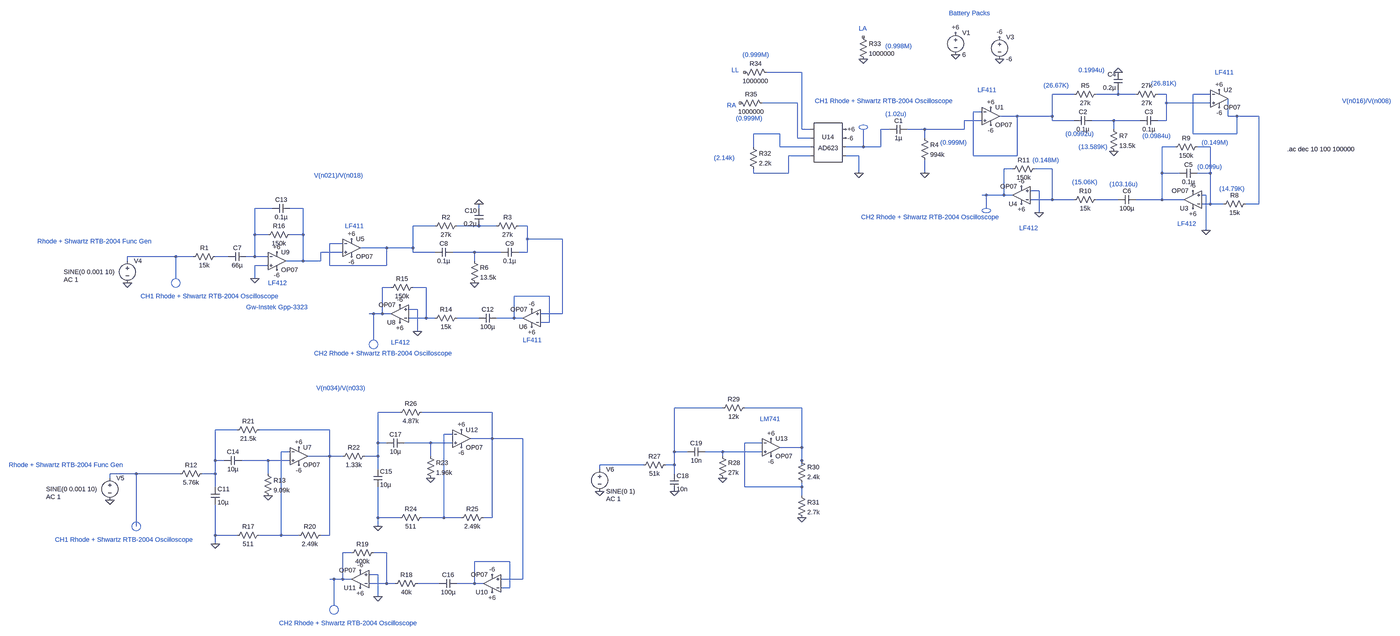
[diagram p0: schematic ECG_Circuit.asc, whole sheet]
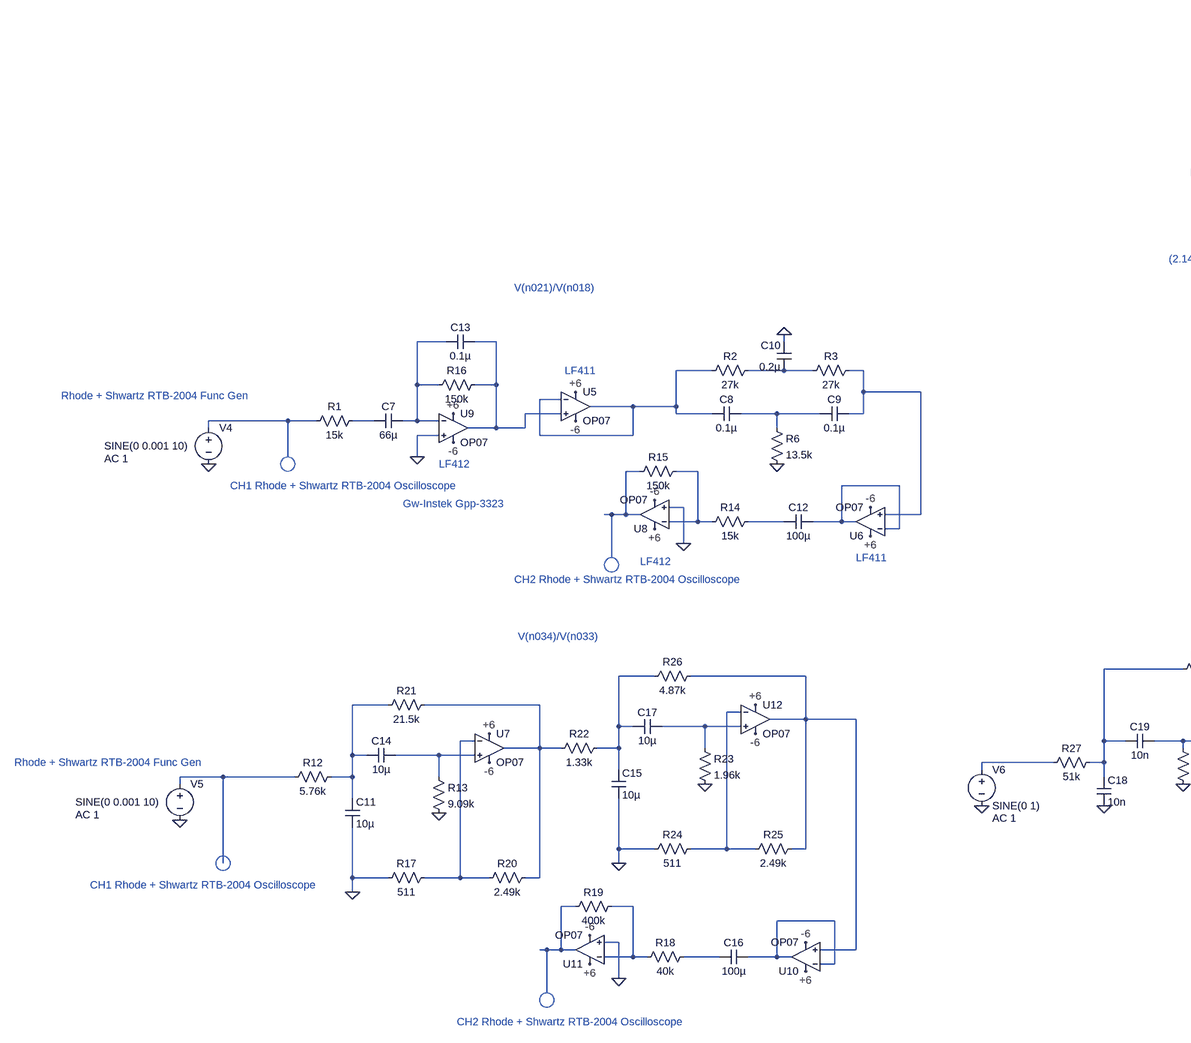
[diagram p1: schematic ECG_Circuit.asc, part, row 1 of 1, column 1 of 2]
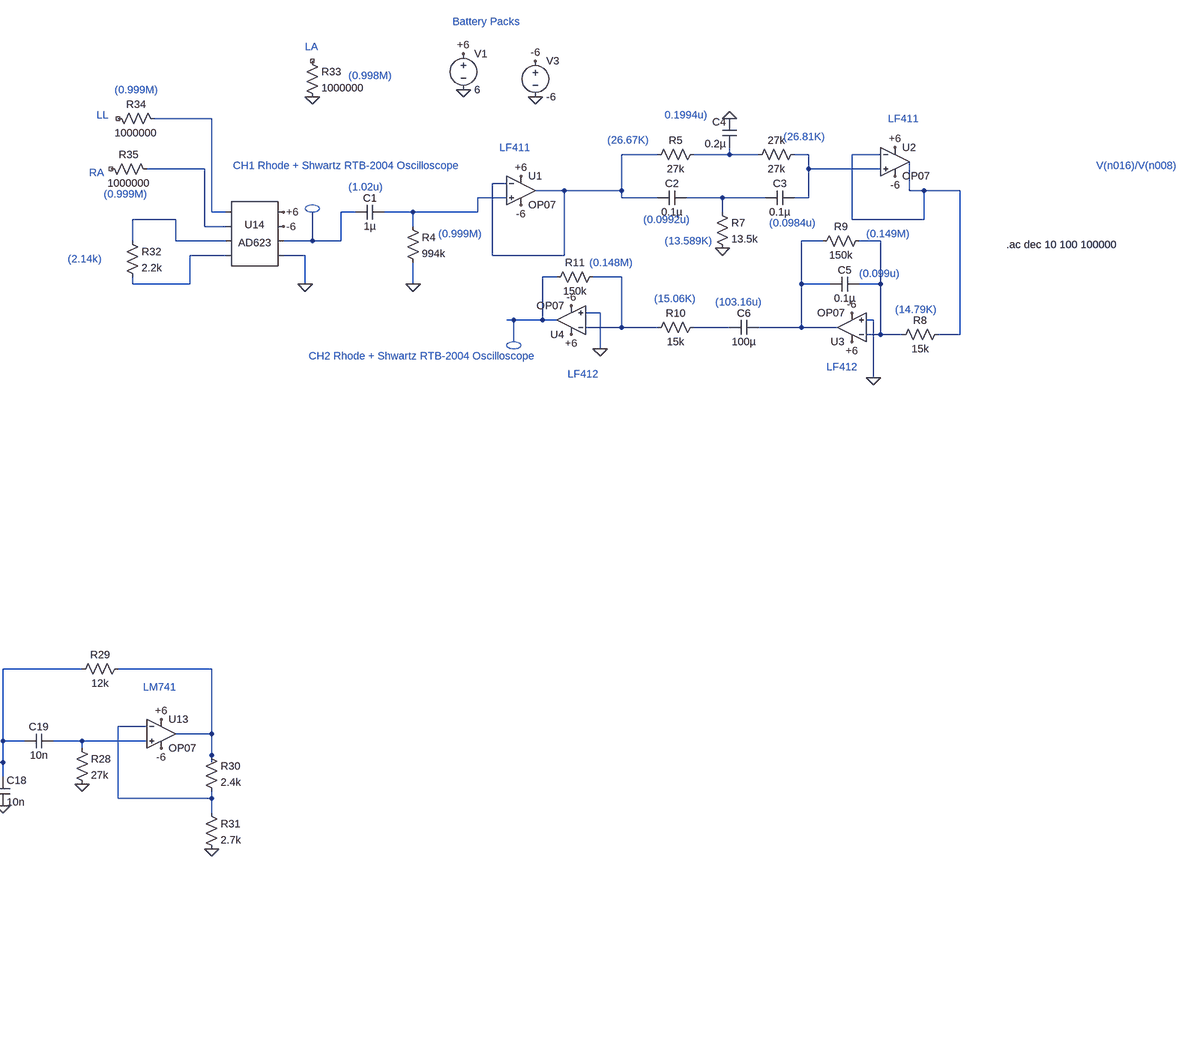
[diagram p2: schematic ECG_Circuit.asc, part, row 1 of 1, column 2 of 2]
ECG_Circuit.asc, the LTspice schematic file:
Version 4
SHEET 1 4284 1440
WIRE 1824 -640 1696 -640
WIRE 2816 -560 2736 -560
WIRE 2976 -560 2976 -576
WIRE 2976 -560 2896 -560
WIRE 3040 -560 2976 -560
WIRE 3152 -560 3120 -560
WIRE 3312 -560 3248 -560
WIRE 1808 -528 1680 -528
WIRE 3152 -528 3152 -560
WIRE 3312 -528 3152 -528
WIRE 2480 -496 2448 -496
WIRE 2608 -480 2544 -480
WIRE 2736 -480 2736 -560
WIRE 2736 -480 2608 -480
WIRE 3376 -480 3376 -544
WIRE 3408 -480 3376 -480
WIRE 3488 -480 3408 -480
WIRE 2480 -464 2416 -464
WIRE 2736 -464 2736 -480
WIRE 2816 -464 2736 -464
WIRE 2960 -464 2880 -464
WIRE 3056 -464 2960 -464
WIRE 3152 -464 3152 -528
WIRE 3152 -464 3120 -464
WIRE 1824 -432 1824 -640
WIRE 1856 -432 1824 -432
WIRE 2144 -432 2112 -432
WIRE 2272 -432 2208 -432
WIRE 2416 -432 2416 -464
WIRE 2416 -432 2272 -432
WIRE 2960 -432 2960 -464
WIRE 1744 -416 1648 -416
WIRE 3248 -416 3248 -560
WIRE 3408 -416 3408 -480
WIRE 3408 -416 3248 -416
WIRE 1808 -400 1808 -528
WIRE 1856 -400 1808 -400
WIRE 2272 -400 2272 -432
WIRE 1648 -368 1648 -416
WIRE 1744 -368 1744 -416
WIRE 1856 -368 1744 -368
WIRE 2048 -368 2048 -432
WIRE 2048 -368 1984 -368
WIRE 2112 -368 2112 -432
WIRE 2112 -368 2048 -368
WIRE 3184 -368 3136 -368
WIRE 3312 -368 3264 -368
WIRE 1856 -336 1776 -336
WIRE 2032 -336 1984 -336
WIRE 2448 -336 2448 -496
WIRE 2608 -336 2608 -480
WIRE 2608 -336 2448 -336
WIRE 2592 -288 2560 -288
WIRE 2736 -288 2672 -288
WIRE 1648 -272 1648 -288
WIRE 1776 -272 1776 -336
WIRE 1776 -272 1648 -272
WIRE 2032 -272 2032 -336
WIRE 2272 -272 2272 -320
WIRE 3136 -272 3136 -368
WIRE 3200 -272 3136 -272
WIRE 3312 -272 3312 -368
WIRE 3312 -272 3264 -272
WIRE 2688 -208 2656 -208
WIRE 2496 -192 2480 -192
WIRE 2560 -192 2560 -288
WIRE 2560 -192 2496 -192
WIRE 2592 -192 2560 -192
WIRE 3296 -192 3280 -192
WIRE 2736 -176 2736 -288
WIRE 2736 -176 2656 -176
WIRE 2816 -176 2736 -176
WIRE 2976 -176 2896 -176
WIRE 3136 -176 3136 -272
WIRE 3136 -176 3040 -176
WIRE 3216 -176 3136 -176
WIRE 3312 -160 3312 -272
WIRE 3312 -160 3280 -160
WIRE 3360 -160 3312 -160
WIRE 3488 -160 3488 -480
WIRE 3488 -160 3440 -160
WIRE -240 -144 -304 -144
WIRE -128 -144 -176 -144
WIRE 512 -144 512 -160
WIRE 2496 -144 2496 -192
WIRE 2688 -128 2688 -208
WIRE 352 -80 272 -80
WIRE 512 -80 512 -96
WIRE 512 -80 432 -80
WIRE 576 -80 512 -80
WIRE 688 -80 656 -80
WIRE 3296 -64 3296 -192
WIRE -304 -48 -304 -144
WIRE -256 -48 -304 -48
WIRE -128 -48 -128 -144
WIRE -128 -48 -176 -48
WIRE 688 -32 688 -80
WIRE 816 -32 688 -32
WIRE 16 -16 -32 -16
WIRE 176 0 80 0
WIRE 272 0 272 -80
WIRE 272 0 176 0
WIRE 16 16 -64 16
WIRE 272 16 272 0
WIRE 352 16 272 16
WIRE 496 16 416 16
WIRE 592 16 496 16
WIRE 688 16 688 -32
WIRE 688 16 656 16
WIRE -592 32 -768 32
WIRE -528 32 -592 32
WIRE -400 32 -448 32
WIRE -304 32 -304 -48
WIRE -304 32 -336 32
WIRE -256 32 -304 32
WIRE -768 48 -768 32
WIRE -128 48 -128 -48
WIRE -128 48 -192 48
WIRE -64 48 -64 16
WIRE -64 48 -128 48
WIRE 496 48 496 16
WIRE -256 64 -304 64
WIRE -32 64 -32 -16
WIRE 176 64 176 0
WIRE 176 64 -32 64
WIRE -592 112 -592 32
WIRE -304 112 -304 64
WIRE 192 144 160 144
WIRE 320 144 272 144
WIRE 768 176 640 176
WIRE 288 224 256 224
WIRE 128 240 112 240
WIRE 160 240 160 144
WIRE 160 240 128 240
WIRE 192 240 160 240
WIRE 816 240 816 -32
WIRE 816 240 736 240
WIRE 320 256 320 144
WIRE 320 256 256 256
WIRE 352 256 320 256
WIRE 512 256 432 256
WIRE 640 256 640 176
WIRE 640 256 576 256
WIRE 672 256 640 256
WIRE 768 272 768 176
WIRE 768 272 736 272
WIRE 288 304 288 224
WIRE 128 336 128 240
WIRE 1536 640 1360 640
WIRE 1824 640 1616 640
WIRE 224 656 144 656
WIRE 560 656 304 656
WIRE -368 720 -448 720
WIRE -32 720 -288 720
WIRE 416 736 384 736
WIRE 560 752 560 656
WIRE 560 752 480 752
WIRE 672 752 560 752
WIRE 144 768 144 656
WIRE 176 768 144 768
WIRE 336 768 240 768
WIRE 416 768 336 768
WIRE 1680 768 1616 768
WIRE 1824 784 1824 640
WIRE 1824 784 1744 784
WIRE -176 800 -208 800
WIRE 1360 800 1360 640
WIRE 1408 800 1360 800
WIRE 1536 800 1472 800
WIRE 1680 800 1536 800
WIRE -32 816 -32 720
WIRE -32 816 -112 816
WIRE 16 816 -32 816
WIRE 144 816 144 768
WIRE 144 816 96 816
WIRE 336 816 336 768
WIRE 1536 816 1536 800
WIRE -448 832 -448 720
WIRE -416 832 -448 832
WIRE -256 832 -352 832
WIRE -176 832 -256 832
WIRE 1824 832 1824 784
WIRE 1248 848 1088 848
WIRE 1360 848 1360 800
WIRE 1360 848 1328 848
WIRE 1824 848 1824 832
WIRE 144 864 144 816
WIRE 1088 864 1088 848
WIRE -736 880 -832 880
WIRE -576 880 -736 880
WIRE -448 880 -448 832
WIRE -448 880 -496 880
WIRE -256 880 -256 832
WIRE 1360 880 1360 848
WIRE -832 896 -832 880
WIRE -448 928 -448 880
WIRE 1616 928 1616 768
WIRE 1824 928 1824 912
WIRE 1824 928 1616 928
WIRE 1824 960 1824 928
WIRE 144 1040 144 928
WIRE 224 1040 144 1040
WIRE 384 1040 384 736
WIRE 384 1040 304 1040
WIRE 448 1040 384 1040
WIRE 560 1040 560 752
WIRE 560 1040 528 1040
WIRE -736 1072 -736 880
WIRE 144 1072 144 1040
WIRE -448 1104 -448 992
WIRE -368 1104 -448 1104
WIRE -208 1104 -208 800
WIRE -208 1104 -288 1104
WIRE -144 1104 -208 1104
WIRE -32 1104 -32 816
WIRE -32 1104 -64 1104
WIRE -448 1136 -448 1104
WIRE 48 1168 16 1168
WIRE 176 1168 128 1168
WIRE 624 1200 496 1200
WIRE 144 1248 112 1248
WIRE -16 1264 -32 1264
WIRE 16 1264 16 1168
WIRE 16 1264 -16 1264
WIRE 48 1264 16 1264
WIRE 672 1264 672 752
WIRE 672 1264 592 1264
WIRE 176 1280 176 1168
WIRE 176 1280 112 1280
WIRE 208 1280 176 1280
WIRE 368 1280 288 1280
WIRE 496 1280 496 1200
WIRE 496 1280 432 1280
WIRE 528 1280 496 1280
WIRE 624 1296 624 1200
WIRE 624 1296 592 1296
WIRE 144 1328 144 1248
WIRE -16 1360 -16 1264
FLAG 2272 -272 0
FLAG 2384 -704 0
FLAG 2544 -688 0
FLAG 2384 -784 +6
FLAG 2544 -768 -6
FLAG 2976 -640 0
FLAG 2960 -352 0
FLAG 3296 -64 0
FLAG 2688 -128 0
FLAG 2512 -512 +6
FLAG 3344 -576 +6
FLAG 3248 -144 +6
FLAG 2624 -160 +6
FLAG 2512 -448 -6
FLAG 3344 -512 -6
FLAG 3248 -208 -6
FLAG 2624 -224 -6
FLAG 512 -160 0
FLAG 496 128 0
FLAG 288 304 0
FLAG 48 -32 +6
FLAG 704 288 +6
FLAG 224 272 +6
FLAG 48 32 -6
FLAG 704 224 -6
FLAG 224 208 -6
FLAG -304 112 0
FLAG -224 16 +6
FLAG -224 80 -6
FLAG -768 128 0
FLAG 144 1328 0
FLAG 560 1312 +6
FLAG 80 1296 +6
FLAG 560 1248 -6
FLAG 80 1232 -6
FLAG -832 976 0
FLAG -256 960 0
FLAG -448 1136 0
FLAG 336 896 0
FLAG 144 1072 0
FLAG -144 784 +6
FLAG 448 720 +6
FLAG 448 784 -6
FLAG -144 848 -6
FLAG 1088 944 0
FLAG 1360 944 0
FLAG 1536 896 0
FLAG 1824 1040 0
FLAG 1712 752 +6
FLAG 1712 816 -6
FLAG 2032 -272 0
FLAG 2048 -688 0
FLAG 1984 -432 +6
FLAG 1984 -400 -6
SYMBOL cap 2208 -448 R90
WINDOW 0 0 32 VBottom 2
WINDOW 3 32 32 VTop 2
SYMATTR InstName C1
SYMATTR Value 1µ
SYMATTR SpiceLine V=16 Irms=0 Rser=0.0237 Lser=872p mfg="Würth Elektronik" pn="885382207001 WCAP-CSST 0805" type="X7R"
SYMBOL res 2256 -416 R0
SYMATTR InstName R4
SYMATTR Value 994k
SYMBOL voltage 2384 -800 R0
WINDOW 123 0 0 Left 0
WINDOW 39 0 0 Left 0
SYMATTR InstName V1
SYMATTR Value 6
SYMBOL voltage 2544 -784 R0
WINDOW 123 0 0 Left 0
WINDOW 39 0 0 Left 0
SYMATTR InstName V3
SYMATTR Value -6
SYMBOL res 2912 -576 R90
WINDOW 0 0 56 VBottom 2
WINDOW 3 32 56 VTop 2
SYMATTR InstName R5
SYMATTR Value 27k
SYMBOL res 3136 -576 R90
WINDOW 0 0 56 VBottom 2
WINDOW 3 32 56 VTop 2
SYMATTR InstName 27k
SYMATTR Value 27k
SYMBOL cap 2880 -480 R90
WINDOW 0 0 32 VBottom 2
WINDOW 3 32 32 VTop 2
SYMATTR InstName C2
SYMATTR Value 0.1µ
SYMBOL cap 3120 -480 R90
WINDOW 0 0 32 VBottom 2
WINDOW 3 32 32 VTop 2
SYMATTR InstName C3
SYMATTR Value 0.1µ
SYMBOL cap 2992 -576 R180
WINDOW 0 24 56 Left 2
WINDOW 3 24 8 Left 2
SYMATTR InstName C4
SYMATTR Value 0.2µ
SYMBOL res 2944 -448 R0
SYMATTR InstName R7
SYMATTR Value 13.5k
SYMBOL res 3456 -176 R90
WINDOW 0 0 56 VBottom 2
WINDOW 3 32 56 VTop 2
SYMATTR InstName R8
SYMATTR Value 15k
SYMBOL cap 3264 -288 R90
WINDOW 0 0 32 VBottom 2
WINDOW 3 32 32 VTop 2
SYMATTR InstName C5
SYMATTR Value 0.1µ
SYMBOL res 3280 -384 R90
WINDOW 0 0 56 VBottom 2
WINDOW 3 32 56 VTop 2
SYMATTR InstName R9
SYMATTR Value 150k
SYMBOL res 2912 -192 R90
WINDOW 0 0 56 VBottom 2
WINDOW 3 32 56 VTop 2
SYMATTR InstName R10
SYMATTR Value 15k
SYMBOL res 2688 -304 R90
WINDOW 0 0 56 VBottom 2
WINDOW 3 32 56 VTop 2
SYMATTR InstName R11
SYMATTR Value 150k
SYMBOL OpAmps\\OP07 2512 -544 R0
SYMATTR InstName U1
SYMBOL OpAmps\\OP07 3344 -608 R0
SYMATTR InstName U2
SYMBOL OpAmps\\OP07 3248 -112 R180
SYMATTR InstName U3
SYMBOL OpAmps\\OP07 2624 -128 R180
SYMATTR InstName U4
SYMBOL cap 3040 -192 R90
WINDOW 0 0 32 VBottom 2
WINDOW 3 32 32 VTop 2
SYMATTR InstName C6
SYMATTR Value 100µ
SYMBOL res 448 -96 R90
WINDOW 0 0 56 VBottom 2
WINDOW 3 32 56 VTop 2
SYMATTR InstName R2
SYMATTR Value 27k
SYMBOL res 672 -96 R90
WINDOW 0 0 56 VBottom 2
WINDOW 3 32 56 VTop 2
SYMATTR InstName R3
SYMATTR Value 27k
SYMBOL cap 416 0 R90
WINDOW 0 0 32 VBottom 2
WINDOW 3 32 32 VTop 2
SYMATTR InstName C8
SYMATTR Value 0.1µ
SYMBOL cap 656 0 R90
WINDOW 0 0 32 VBottom 2
WINDOW 3 32 32 VTop 2
SYMATTR InstName C9
SYMATTR Value 0.1µ
SYMBOL cap 528 -80 R180
WINDOW 0 24 56 Left 2
WINDOW 3 24 8 Left 2
SYMATTR InstName C10
SYMATTR Value 0.2µ
SYMBOL res 480 32 R0
SYMATTR InstName R6
SYMATTR Value 13.5k
SYMBOL res 448 240 R90
WINDOW 0 0 56 VBottom 2
WINDOW 3 32 56 VTop 2
SYMATTR InstName R14
SYMATTR Value 15k
SYMBOL res 288 128 R90
WINDOW 0 0 56 VBottom 2
WINDOW 3 32 56 VTop 2
SYMATTR InstName R15
SYMATTR Value 150k
SYMBOL OpAmps\\OP07 48 -64 R0
SYMATTR InstName U5
SYMBOL OpAmps\\OP07 704 320 R180
SYMATTR InstName U6
SYMBOL OpAmps\\OP07 224 304 R180
SYMATTR InstName U8
SYMBOL cap 576 240 R90
WINDOW 0 0 32 VBottom 2
WINDOW 3 32 32 VTop 2
SYMATTR InstName C12
SYMATTR Value 100µ
SYMBOL res -432 16 R90
WINDOW 0 0 56 VBottom 2
WINDOW 3 32 56 VTop 2
SYMATTR InstName R1
SYMATTR Value 15k
SYMBOL cap -336 16 R90
WINDOW 0 0 32 VBottom 2
WINDOW 3 32 32 VTop 2
SYMATTR InstName C7
SYMATTR Value 66µ
SYMBOL OpAmps\\OP07 -224 -16 R0
SYMATTR InstName U9
SYMBOL res -160 -64 R90
WINDOW 0 0 56 VBottom 2
WINDOW 3 32 56 VTop 2
SYMATTR InstName R16
SYMATTR Value 150k
SYMBOL cap -176 -160 R90
WINDOW 0 0 32 VBottom 2
WINDOW 3 32 32 VTop 2
SYMATTR InstName C13
SYMATTR Value 0.1µ
SYMBOL voltage -768 32 R0
WINDOW 3 -232 56 Left 2
WINDOW 123 -232 84 Left 2
WINDOW 39 0 0 Left 0
SYMATTR Value SINE(0 0.001 10)
SYMATTR Value2 AC 1
SYMATTR InstName V4
SYMBOL res 304 1264 R90
WINDOW 0 0 56 VBottom 2
WINDOW 3 32 56 VTop 2
SYMATTR InstName R18
SYMATTR Value 40k
SYMBOL res 144 1152 R90
WINDOW 0 0 56 VBottom 2
WINDOW 3 32 56 VTop 2
SYMATTR InstName R19
SYMATTR Value 400k
SYMBOL OpAmps\\OP07 560 1344 R180
SYMATTR InstName U10
SYMBOL OpAmps\\OP07 80 1328 R180
SYMATTR InstName U11
SYMBOL cap 432 1264 R90
WINDOW 0 0 32 VBottom 2
WINDOW 3 32 32 VTop 2
SYMATTR InstName C16
SYMATTR Value 100µ
SYMBOL voltage -832 880 R0
WINDOW 3 -232 56 Left 2
WINDOW 123 -232 84 Left 2
WINDOW 39 0 0 Left 0
SYMATTR Value SINE(0 0.001 10)
SYMATTR Value2 AC 1
SYMATTR InstName V5
SYMBOL res -480 864 R90
WINDOW 0 0 56 VBottom 2
WINDOW 3 32 56 VTop 2
SYMATTR InstName R12
SYMATTR Value 5.76k
SYMBOL cap -464 928 R0
SYMATTR InstName C11
SYMATTR Value 10µ
SYMBOL cap -352 816 R90
WINDOW 0 0 32 VBottom 2
WINDOW 3 32 32 VTop 2
SYMATTR InstName C14
SYMATTR Value 10µ
SYMBOL res -272 864 R0
SYMATTR InstName R13
SYMATTR Value 9.09k
SYMBOL res -272 1088 R90
WINDOW 0 0 56 VBottom 2
WINDOW 3 32 56 VTop 2
SYMATTR InstName R17
SYMATTR Value 511
SYMBOL res -48 1088 R90
WINDOW 0 0 56 VBottom 2
WINDOW 3 32 56 VTop 2
SYMATTR InstName R20
SYMATTR Value 2.49k
SYMBOL res -272 704 R90
WINDOW 0 0 56 VBottom 2
WINDOW 3 32 56 VTop 2
SYMATTR InstName R21
SYMATTR Value 21.5k
SYMBOL OpAmps\\OP07 -144 752 R0
SYMATTR InstName U7
SYMBOL res 112 800 R90
WINDOW 0 0 56 VBottom 2
WINDOW 3 32 56 VTop 2
SYMATTR InstName R22
SYMATTR Value 1.33k
SYMBOL cap 128 864 R0
SYMATTR InstName C15
SYMATTR Value 10µ
SYMBOL cap 240 752 R90
WINDOW 0 0 32 VBottom 2
WINDOW 3 32 32 VTop 2
SYMATTR InstName C17
SYMATTR Value 10µ
SYMBOL res 320 800 R0
SYMATTR InstName R23
SYMATTR Value 1.96k
SYMBOL res 320 1024 R90
WINDOW 0 0 56 VBottom 2
WINDOW 3 32 56 VTop 2
SYMATTR InstName R24
SYMATTR Value 511
SYMBOL res 544 1024 R90
WINDOW 0 0 56 VBottom 2
WINDOW 3 32 56 VTop 2
SYMATTR InstName R25
SYMATTR Value 2.49k
SYMBOL res 320 640 R90
WINDOW 0 0 56 VBottom 2
WINDOW 3 32 56 VTop 2
SYMATTR InstName R26
SYMATTR Value 4.87k
SYMBOL OpAmps\\OP07 448 688 R0
SYMATTR InstName U12
SYMBOL voltage 1088 848 R0
WINDOW 123 24 124 Left 2
WINDOW 39 0 0 Left 0
SYMATTR Value2 AC 1
SYMATTR InstName V6
SYMATTR Value SINE(0 1)
SYMBOL res 1344 832 R90
WINDOW 0 0 56 VBottom 2
WINDOW 3 32 56 VTop 2
SYMATTR InstName R27
SYMATTR Value 51k
SYMBOL cap 1344 880 R0
SYMATTR InstName C18
SYMATTR Value 10n
SYMBOL cap 1472 784 R90
WINDOW 0 0 32 VBottom 2
WINDOW 3 32 32 VTop 2
SYMATTR InstName C19
SYMATTR Value 10n
SYMBOL res 1520 800 R0
SYMATTR InstName R28
SYMATTR Value 27k
SYMBOL res 1632 624 R90
WINDOW 0 0 56 VBottom 2
WINDOW 3 32 56 VTop 2
SYMATTR InstName R29
SYMATTR Value 12k
SYMBOL OpAmps\\OP07 1712 720 R0
SYMATTR InstName U13
SYMBOL res 1808 816 R0
SYMATTR InstName R30
SYMATTR Value 2.4k
SYMBOL res 1808 944 R0
SYMATTR InstName R31
SYMATTR Value 2.7k
SYMBOL AutoGenerated\\AD623 1920 -384 R0
SYMATTR InstName U14
SYMBOL res 1632 -384 R0
SYMATTR InstName R32
SYMATTR Value 2.2k
SYMBOL res 2032 -784 R0
SYMATTR InstName R33
SYMATTR Value 1000000
SYMBOL res 1600 -656 M90
WINDOW 0 0 56 VBottom 2
WINDOW 3 32 56 VTop 2
SYMATTR InstName R34
SYMATTR Value 1000000
SYMBOL res 1584 -544 M90
WINDOW 0 0 56 VBottom 2
WINDOW 3 32 56 VTop 2
SYMATTR InstName R35
SYMATTR Value 1000000
TEXT 3880 -360 Left 2 !.ac dec 10 100 100000
TEXT -720 176 Left 2 ;CH1 Rhode + Shwartz RTB-2004 Oscilloscope
TEXT -88 384 Left 2 ;CH2 Rhode + Shwartz RTB-2004 Oscilloscope
TEXT 24 -80 Left 2 ;LF411
TEXT 672 336 Left 2 ;LF411
TEXT 192 344 Left 2 ;LF412
TEXT -256 128 Left 2 ;LF412
TEXT -336 216 Left 2 ;Gw-Instek Gpp-3323
TEXT -1096 -24 Left 2 ;Rhode + Shwartz RTB-2004 Func Gen
TEXT -88 -264 Left 2 ;V(n021)/V(n018)
TEXT 4080 -536 Left 2 ;V(n016)/V(n008)
TEXT -1032 1120 Left 2 ;CH1 Rhode + Shwartz RTB-2004 Oscilloscope
TEXT -216 1424 Left 2 ;CH2 Rhode + Shwartz RTB-2004 Oscilloscope
TEXT -1200 848 Left 2 ;Rhode + Shwartz RTB-2004 Func Gen
TEXT -80 568 Left 2 ;V(n034)/V(n033)
TEXT 2360 -856 Left 2 ;Battery Packs
TEXT 1672 680 Left 2 ;LM741
TEXT 2464 -576 Left 2 ;LF411
TEXT 3328 -640 Left 2 ;LF411
TEXT 3192 -88 Left 2 ;LF412
TEXT 2616 -72 Left 2 ;LF412
TEXT 1568 -648 Left 2 ;LL
TEXT 1552 -520 Left 2 ;RA
TEXT 2032 -800 Left 2 ;LA
TEXT 1608 -704 Left 2 ;(0.999M)
TEXT 1584 -472 Left 2 ;(0.999M)
TEXT 2128 -736 Left 2 ;(0.998M)
TEXT 1504 -328 Left 2 ;(2.14k)
TEXT 2328 -384 Left 2 ;(0.999M)
TEXT 2664 -320 Left 2 ;(0.148M)
TEXT 3280 -384 Left 2 ;(0.149M)
TEXT 2808 -240 Left 2 ;(15.06K)
TEXT 2784 -416 Left 2 ;(0.0992u)
TEXT 3064 -408 Left 2 ;(0.0984u)
TEXT 2832 -648 Left 2 ;0.1994u)
TEXT 2704 -592 Left 2 ;(26.67K)
TEXT 3096 -600 Left 2 ;(26.81K)
TEXT 2832 -368 Left 2 ;(13.589K)
TEXT 2128 -488 Left 2 ;(1.02u)
TEXT 2944 -232 Left 2 ;(103.16u)
TEXT 3344 -216 Left 2 ;(14.79K)
TEXT 3264 -296 Left 2 ;(0.099u)
TEXT 1872 -536 Left 2 ;CH1 Rhode + Shwartz RTB-2004 Oscilloscope
TEXT 2040 -112 Left 2 ;CH2 Rhode + Shwartz RTB-2004 Oscilloscope
CIRCLE Normal -576 144 -608 112
CIRCLE Normal 144 368 112 336
CIRCLE Normal 0 1392 -32 1360
CIRCLE Normal -720 1088 -752 1056
CIRCLE Normal 2064 -432 2032 -448
CIRCLE Normal 2512 -128 2480 -144

The netlist it stands for:
* ECG_Circuit.asc
C1 N007 N009 1µ V=16 Irms=0 Rser=0.0237 Lser=872p mfg="Würth Elektronik" pn="885382207001 WCAP-CSST 0805" type="X7R"
R4 N007 0 994k
V1 +6 0 6
V3 -6 0 -6
R5 N003 N002 27k
R§27k N004 N003 27k
C2 N008 N002 0.1µ
C3 N004 N008 0.1µ
C4 N003 0 0.2µ
R7 N008 0 13.5k
R8 N005 N012 15k
C5 N012 N011 0.1µ
R9 N012 N011 150k
R10 N016 N015 15k
R11 N015 N014 150k
XU1 N007 N002 +6 -6 N002 LT1001  ; OP07, pins In+ In- V+ V- OUT
XU2 N004 N005 +6 -6 N005 LT1001  ; OP07, pins In+ In- V+ V- OUT
XU3 0 N012 +6 -6 N011 LT1001  ; OP07, pins In+ In- V+ V- OUT
XU4 0 N015 +6 -6 N014 LT1001  ; OP07, pins In+ In- V+ V- OUT
C6 N011 N016 100µ
R2 N020 N019 27k
R3 N021 N020 27k
C8 N022 N019 0.1µ
C9 N021 N022 0.1µ
C10 N020 0 0.2µ
R6 N022 0 13.5k
R14 N028 N026 15k
R15 N026 N025 150k
XU5 N018 N019 +6 -6 N019 LT1001  ; OP07, pins In+ In- V+ V- OUT
XU6 N021 N027 +6 -6 N027 LT1001  ; OP07, pins In+ In- V+ V- OUT
XU8 0 N026 +6 -6 N025 LT1001  ; OP07, pins In+ In- V+ V- OUT
C12 N027 N028 100µ
R1 N024 N023 15k
C7 N017 N024 66µ
XU9 0 N017 +6 -6 N018 LT1001  ; OP07, pins In+ In- V+ V- OUT
R16 N018 N017 150k
C13 N018 N017 0.1µ
V4 N023 0 SINE(0 0.001 10) AC 1
R18 N046 N044 40k
R19 N044 N043 400k
XU10 N032 N045 +6 -6 N045 LT1001  ; OP07, pins In+ In- V+ V- OUT
XU11 0 N044 +6 -6 N043 LT1001  ; OP07, pins In+ In- V+ V- OUT
C16 N045 N046 100µ
V5 N042 0 SINE(0 0.001 10) AC 1
R12 N033 N042 5.76k
C11 N033 0 10µ
C14 N040 N033 10µ
R13 N040 0 9.09k
R17 N038 0 511
R20 N034 N038 2.49k
R21 N034 N033 21.5k
XU7 N040 N038 +6 -6 N034 LT1001  ; OP07, pins In+ In- V+ V- OUT
R22 N031 N034 1.33k
C15 N031 0 10µ
C17 N036 N031 10µ
R23 N036 0 1.96k
R24 N035 0 511
R25 N032 N035 2.49k
R26 N032 N031 4.87k
XU12 N036 N035 +6 -6 N032 LT1001  ; OP07, pins In+ In- V+ V- OUT
V6 N041 0 SINE(0 1) AC 1
R27 N029 N041 51k
C18 N029 0 10n
C19 N039 N029 10n
R28 N039 0 27k
R29 N030 N029 12k
XU13 N039 N037 +6 -6 N030 LT1001  ; OP07, pins In+ In- V+ V- OUT
R30 N030 N037 2.4k
R31 N037 0 2.7k
* U14: AD623 (symbol AutoGenerated\AD623 not available, pins judged from their places): pin1=N001 pin2=N006 pin3=N010 pin4=N013 pin5=+6 pin6=-6 pin7=N009 pin8=0
R32 N010 N013 2.2k
R33 NC_01 0 1000000
R34 NC_02 N001 1000000
R35 NC_03 N006 1000000
.ac dec 10 100 100000
* CH1 Rhode + Shwartz RTB-2004 Oscilloscope
* CH2 Rhode + Shwartz RTB-2004 Oscilloscope
* LF411
* LF411
* LF412
* LF412
* Gw-Instek Gpp-3323
* Rhode + Shwartz RTB-2004 Func Gen
* V(n021)/V(n018)
* V(n016)/V(n008)
* CH1 Rhode + Shwartz RTB-2004 Oscilloscope
* CH2 Rhode + Shwartz RTB-2004 Oscilloscope
* Rhode + Shwartz RTB-2004 Func Gen
* V(n034)/V(n033)
* Battery Packs
* LM741
* LF411
* LF411
* LF412
* LF412
* LL
* RA
* LA
* (0.999M)
* (0.999M)
* (0.998M)
* (2.14k)
* (0.999M)
* (0.148M)
* (0.149M)
* (15.06K)
* (0.0992u)
* (0.0984u)
* 0.1994u)
* (26.67K)
* (26.81K)
* (13.589K)
* (1.02u)
* (103.16u)
* (14.79K)
* (0.099u)
* CH1 Rhode + Shwartz RTB-2004 Oscilloscope
* CH2 Rhode + Shwartz RTB-2004 Oscilloscope
.lib LTC.lib
.backanno
.end